# Altium schematic sheet A1_ENG.SchDoc: {Title}
size 840 x 594 mm; ApprovedBy: {ApprovedBy}; CheckedBy: {CheckedBy}; Author: {Author}; CompanyName: {CompanyName}; DrawnBy: {DrawnBy}; Engineer: {Engineer}; DocumentNumber: {DocumentNumber}; Title0: {Title0}; Title1: {Title1}; DocumentType: Схема электрическая принципиальная; Liter: {Liter}; Scale: {Scale}; TechControl: {TechControl}; NormControl: {NormControl}; CustomerNumber: {CustomerNumber}; PageSetup: Record=PageOptions|CenterHorizontal=True|CenterVertical=True|PrintScale=0.96|XCorrection=1.00|YCorrection=1.00|PrintKind=1|BorderSize=5000000|LeftOffset=0|BottomOffset=0|Orientation=2|PaperLength=1000|PaperWidth=1000|Scale=100|PaperSource=7|PrintQuality=-4|MediaType=1|DitherType=10|PaperKind=A3|PrintScaleMode=1; FirstApp: {FirstApp}
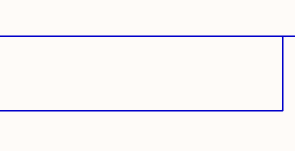
[diagram p0: A1_ENG.SchDoc, top left]
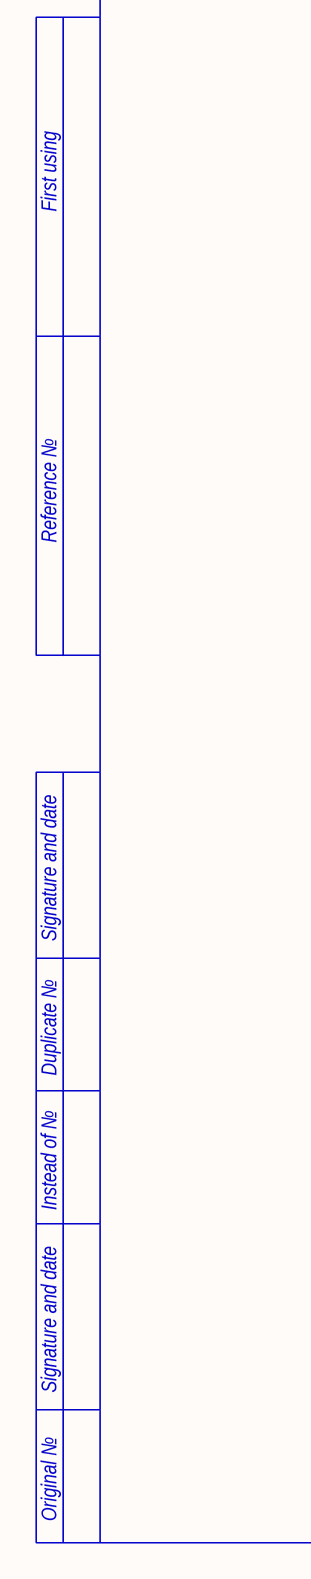
[diagram p1: A1_ENG.SchDoc, bottom left]
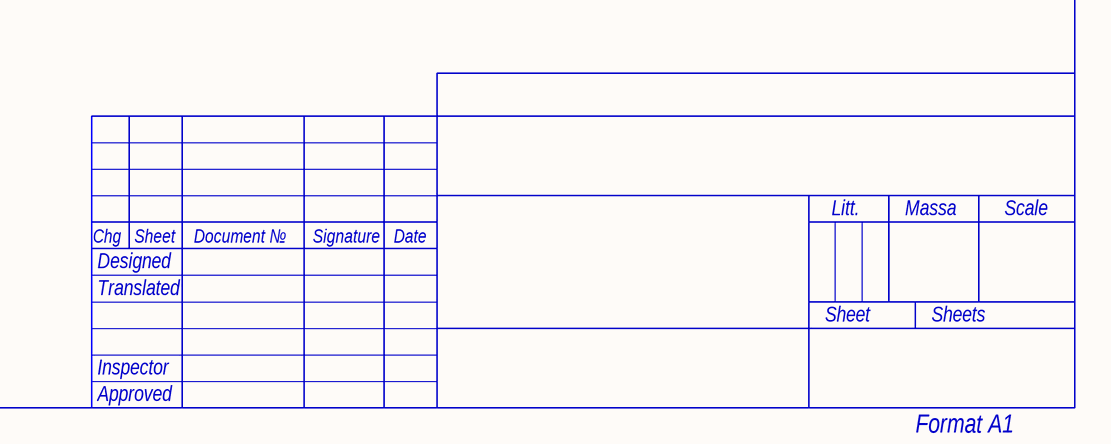
[diagram p2: A1_ENG.SchDoc, bottom right]

## Notes on the sheet
- First using
- Reference №
- Signature and date
- Duplicate №
- Instead of №
- Chg
- Sheet
- Document №
- Signature
- Date
- Litt.
- Massa
- Scale
- Designed
- Translated
- Sheets
- Original №
- Inspector
- Approved
- Format A1